# EAGLE design dskrdy (EAGLE 7.6.0)
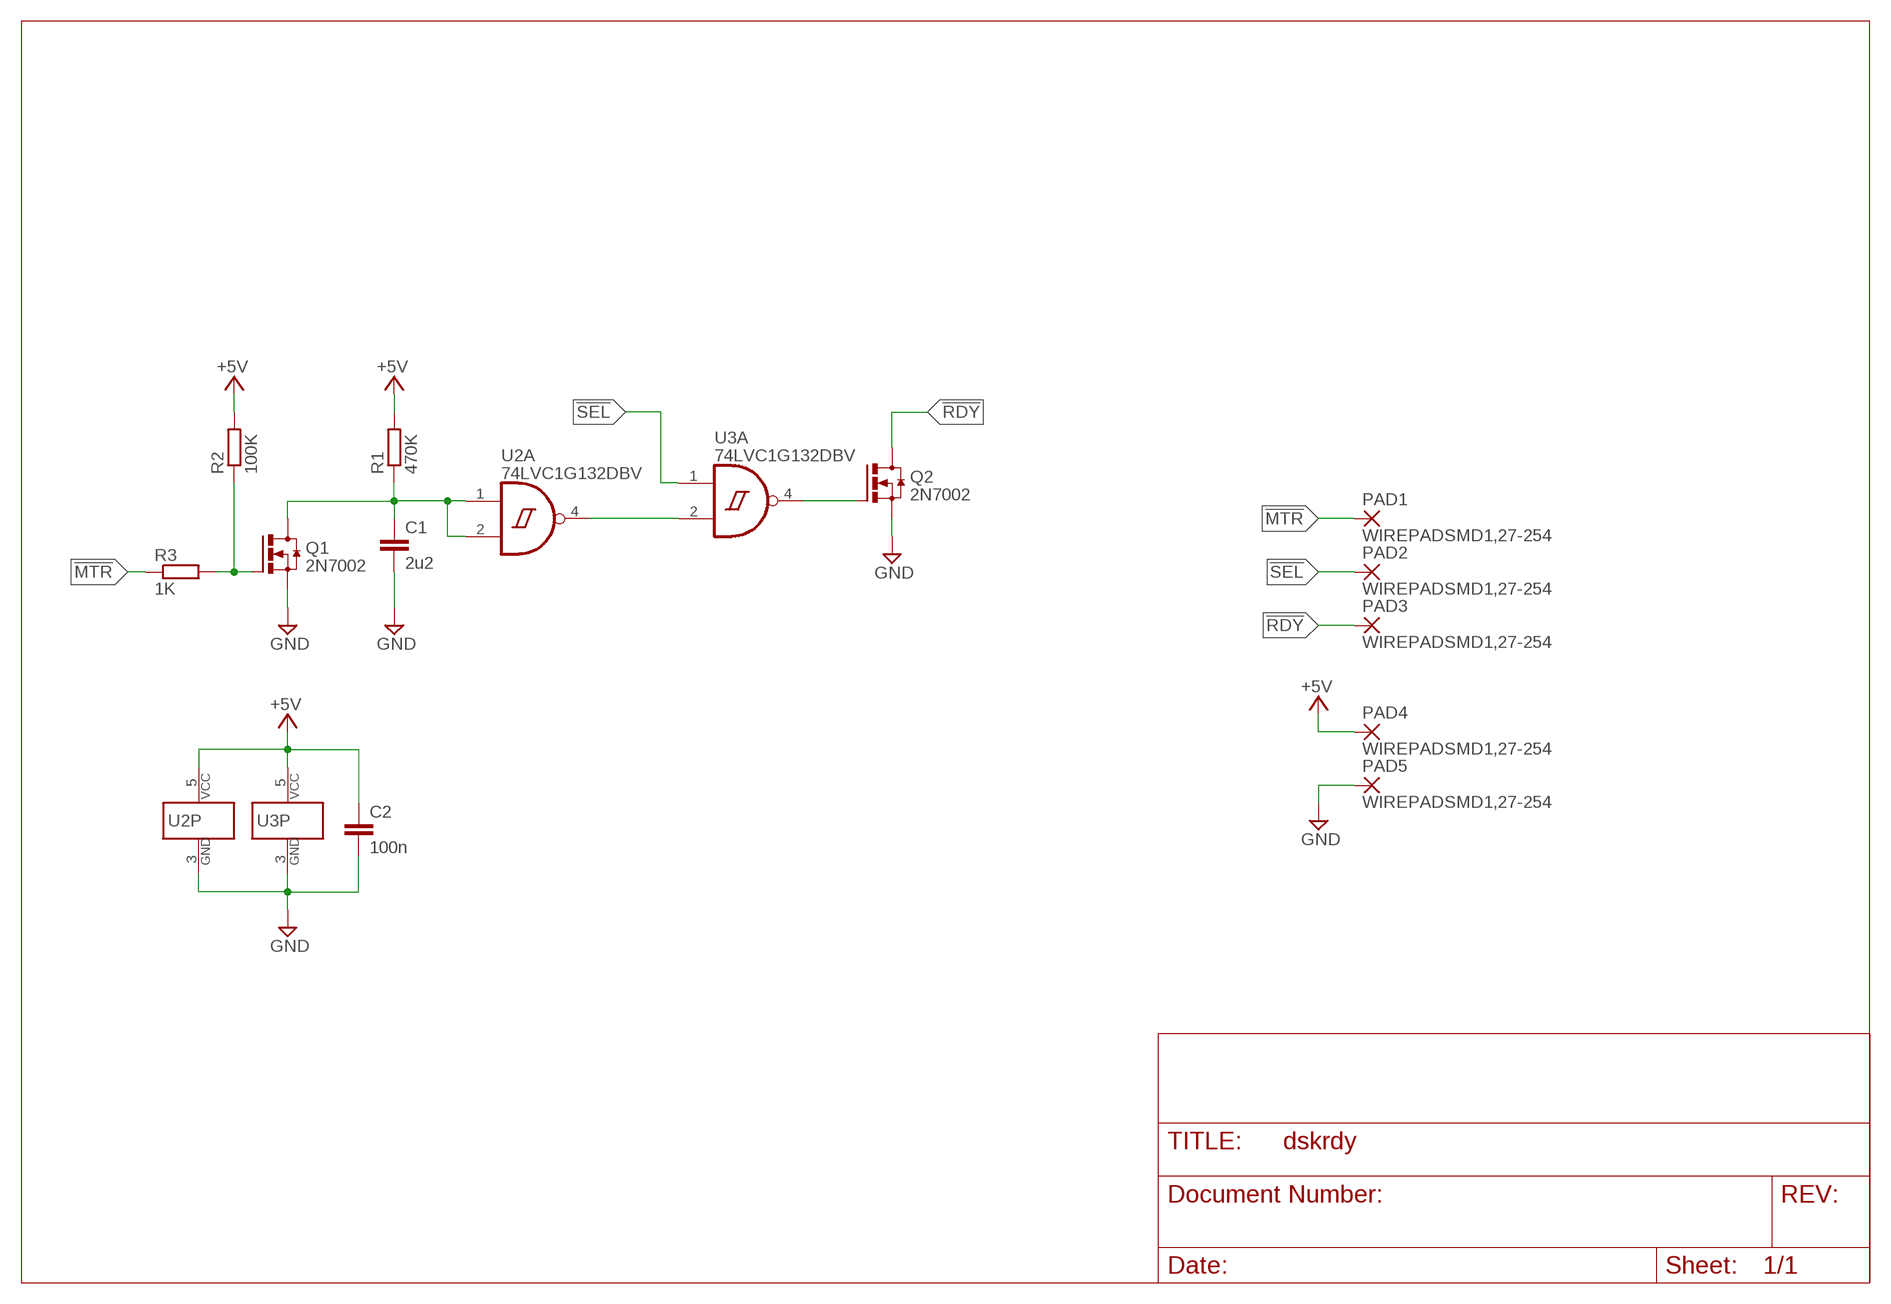
[diagram p0: schematic, sheet 1]

## Parts
C1  2u2  C-EUC0805  [C0805]
C2  100n  C-EUC0805  [C0805]
PAD1  WIREPADSMD1,27-254  [SMD1,27-2,54]
PAD2  WIREPADSMD1,27-254  [SMD1,27-2,54]
PAD3  WIREPADSMD1,27-254  [SMD1,27-2,54]
PAD4  WIREPADSMD1,27-254  [SMD1,27-2,54]
PAD5  WIREPADSMD1,27-254  [SMD1,27-2,54]
Q1  2N7002  -NMOS_SOT23  [SOT23]
Q2  2N7002  -NMOS_SOT23  [SOT23]
R1  470K  R-EU_R0805  [R0805]
R2  100K  R-EU_R0805  [R0805]
R3  1K  R-EU_R0805  [R0805]
U2  74LVC1G132DBV  [SOT23-5]
U3  74LVC1G132DBV  [SOT23-5]

## Nets
!MTR: PAD1.1(P) R3.1
!RDY: PAD3.1(P) Q2.3(D)
!SEL: PAD2.1(P) U3.1(A:I0)
+5V: C2.1 PAD4.1(P) R1.2 R2.2 U2.5(P:VCC) U3.5(P:VCC)
GND: C1.2 C2.2 PAD5.1(P) Q1.2(S) Q2.2(S) U2.3(P:GND) U3.3(P:GND)
N$1: Q1.1(G) R2.1 R3.2
N$2: C1.1 Q1.3(D) R1.1 U2.1(A:I0) U2.2(A:I1)
N$3: Q2.1(G) U3.4(A:O)
N$4: U2.4(A:O) U3.2(A:I1)

## Library data of the parts
C1 C2 = rcl:C-EU: CAPACITOR, European symbol
PAD1-PAD5 = wirepad:WIREPAD: Wire PAD connect wire on PCB
Q1 Q2 = jc-discretesemi:*-NMOS_?
R1-R3 = rcl:R-EU_: RESISTOR, European symbol
U2 U3 = jc-logic:74*1G132: Single 2-input NAND, Schmitt Trigger input

## Board
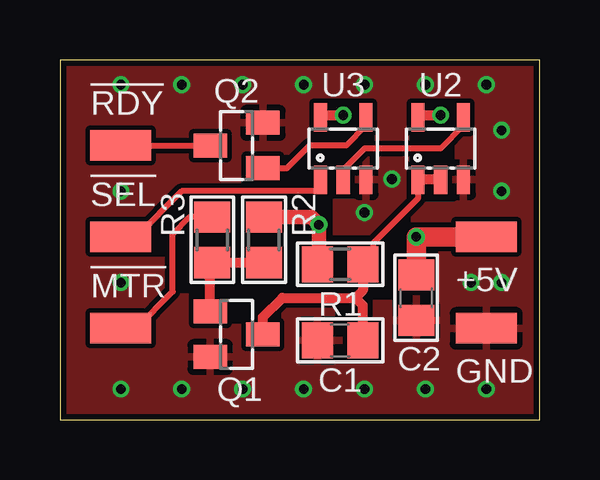
[diagram p1: board, top side]
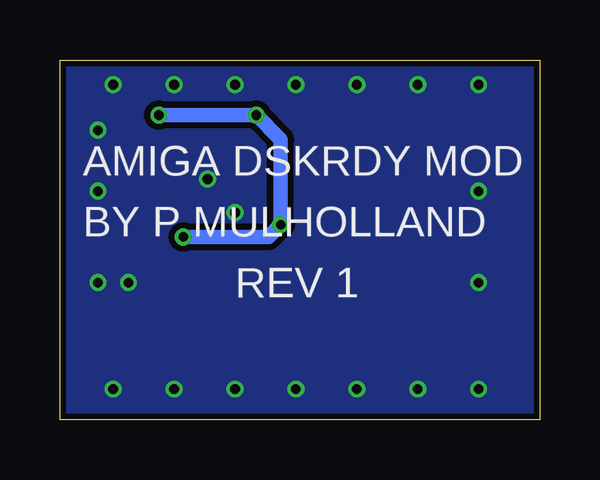
[diagram p2: board, bottom side, seen from below]

Size 20 x 15 mm. Coordinates in mm from the lower left corner, seen from the top.
Outline: 0,0 20,0 20,15 0,15 0,0
Copper layers (1*16): Top 0.035mm / dielectric 1.5mm / Bottom 0.035mm
Design rules "seeed-studio-2-layer": minimum track width 6mil, minimum drill 12mil, track to track 6mil, track to pad 6mil, pad to pad 6mil, via to via 6mil, smd to smd 0mil, copper to edge 10mil, drill to drill 10mil, minimum pad ring 10mil, minimum via ring 6mil, stop-mask expansion 2mil, vias tented up to drill 100mil, thermal gap 10mil
tRestrict: 11 lines

### Footprints (pad centres in the part's own frame; a part is rotated, then mirrored left to right if it is on the bottom)
C0805 = smd 1.3 x 1.5: 1 -0.95,0; 2 0.95,0
SMD1,27-2,54 = smd 1.27 x 2.54: 1 0,0
SOT23 = smd 1 x 1.4: 1 -0.95,-1.1; 2 0.95,-1.1; 3 0,1.1
R0805 = smd 1.3 x 1.5: 1 -0.95,0; 2 0.95,0
SOT23-5 = smd 0.55 x 1.2: 1 -0.95,-1.3; 2 0,-1.3; 3 0.95,-1.3; 4 0.95,1.3; 5 -0.95,1.3

### Placement (x,y rotation side)
C1  11.68,3.3 180 top
C2  14.86,5.08 270 top
PAD1  2.54,3.81 90 top
PAD2  2.54,7.62 90 top
PAD3  2.54,11.43 90 top
PAD4  17.78,7.62 90 top
PAD5  17.78,3.81 90 top
Q1  7.37,3.56 270 top
Q2  7.37,11.43 90 top
R1  11.68,6.48 180 top
R2  8.51,7.49 90 top
R3  6.35,7.49 270 top
U2  15.88,11.3 0 top
U3  11.81,11.3 0 top

### Tracks (layer width: path | path; a pad name or v marks a point on that pad's centre or on a via)
!MTR
  Top 0.254: PAD1.1 3.17,3.81 4.7,5.33 4.7,7.75 5.39,8.44 R3.1
!RDY
  Top 0.254: PAD3.1 Q2.3
!SEL
  Top 0.254: PAD2.1 3.17,7.62 5.08,9.53 10.86,9.53 U3.1
+5V  (via drill 0.4)
  Top 0.406: U3.5 10.86,12.7 v11.81,12.7 | U2.5 14.93,12.7 v15.88,12.7
  Top 0.61: R2.2 10.48,8.44 v10.79,8.13 10.79,6.48 R1.2
  Top 0.813: C2.1 v14.86,7.62 PAD4.1
  Bottom 0.61: v15.88,12.7 v11.81,12.7 10.79,11.68 v10.79,8.13 11.3,7.62 v14.86,7.62
GND  (via drill 0.4)
  other vias: 17.78,1.27 15.24,1.27 12.7,1.27 10.16,1.27 7.62,1.27 5.08,1.27 2.54,1.27 17.78,13.97 15.24,13.97 12.7,13.97 10.16,13.97 7.62,13.97 5.08,13.97 2.54,13.97 18.41,5.71 13.84,10.03 17.14,5.71 18.41,12.06 18.41,9.53 12.7,8.64 2.54,9.53 2.54,5.71
  pour Top (isolate 0.2): 0,15.24 20.32,15.24 20.32,0 0,0
  pour Bottom (isolate 0.254): 0,15.24 20.32,15.24 20.32,0 0,0
N$1
  Top 0.406: R2.1 R3.2 6.27,6.54 Q1.1
N$2
  Top 0.254: R1.1 13.08,6.48 13.08,7.37 14.93,9.21 U2.1
  Top 0.406: U2.2 U2.1 | Q1.3 8.47,4.28 9.27,5.08 12.32,5.08 | C1.1 12.63,4.76 12.32,5.08 | R1.1 12.63,5.39 12.32,5.08
N$3
  Top 0.254: Q2.1 9.46,10.48 10.41,11.43 11.94,11.43 12.76,12.25 U3.4
N$4
  Top 0.254: U3.2 11.81,10.41 12.7,11.3 15.88,11.3 16.82,12.25 U2.4

### Text on the board
tPlace: !RDY | !SEL | +5V | !MTR | GND
bPlace: AMIGA DSKRDY MOD | BY P MULHOLLAND | REV 1